# Altium project ESP32.PrjPcb
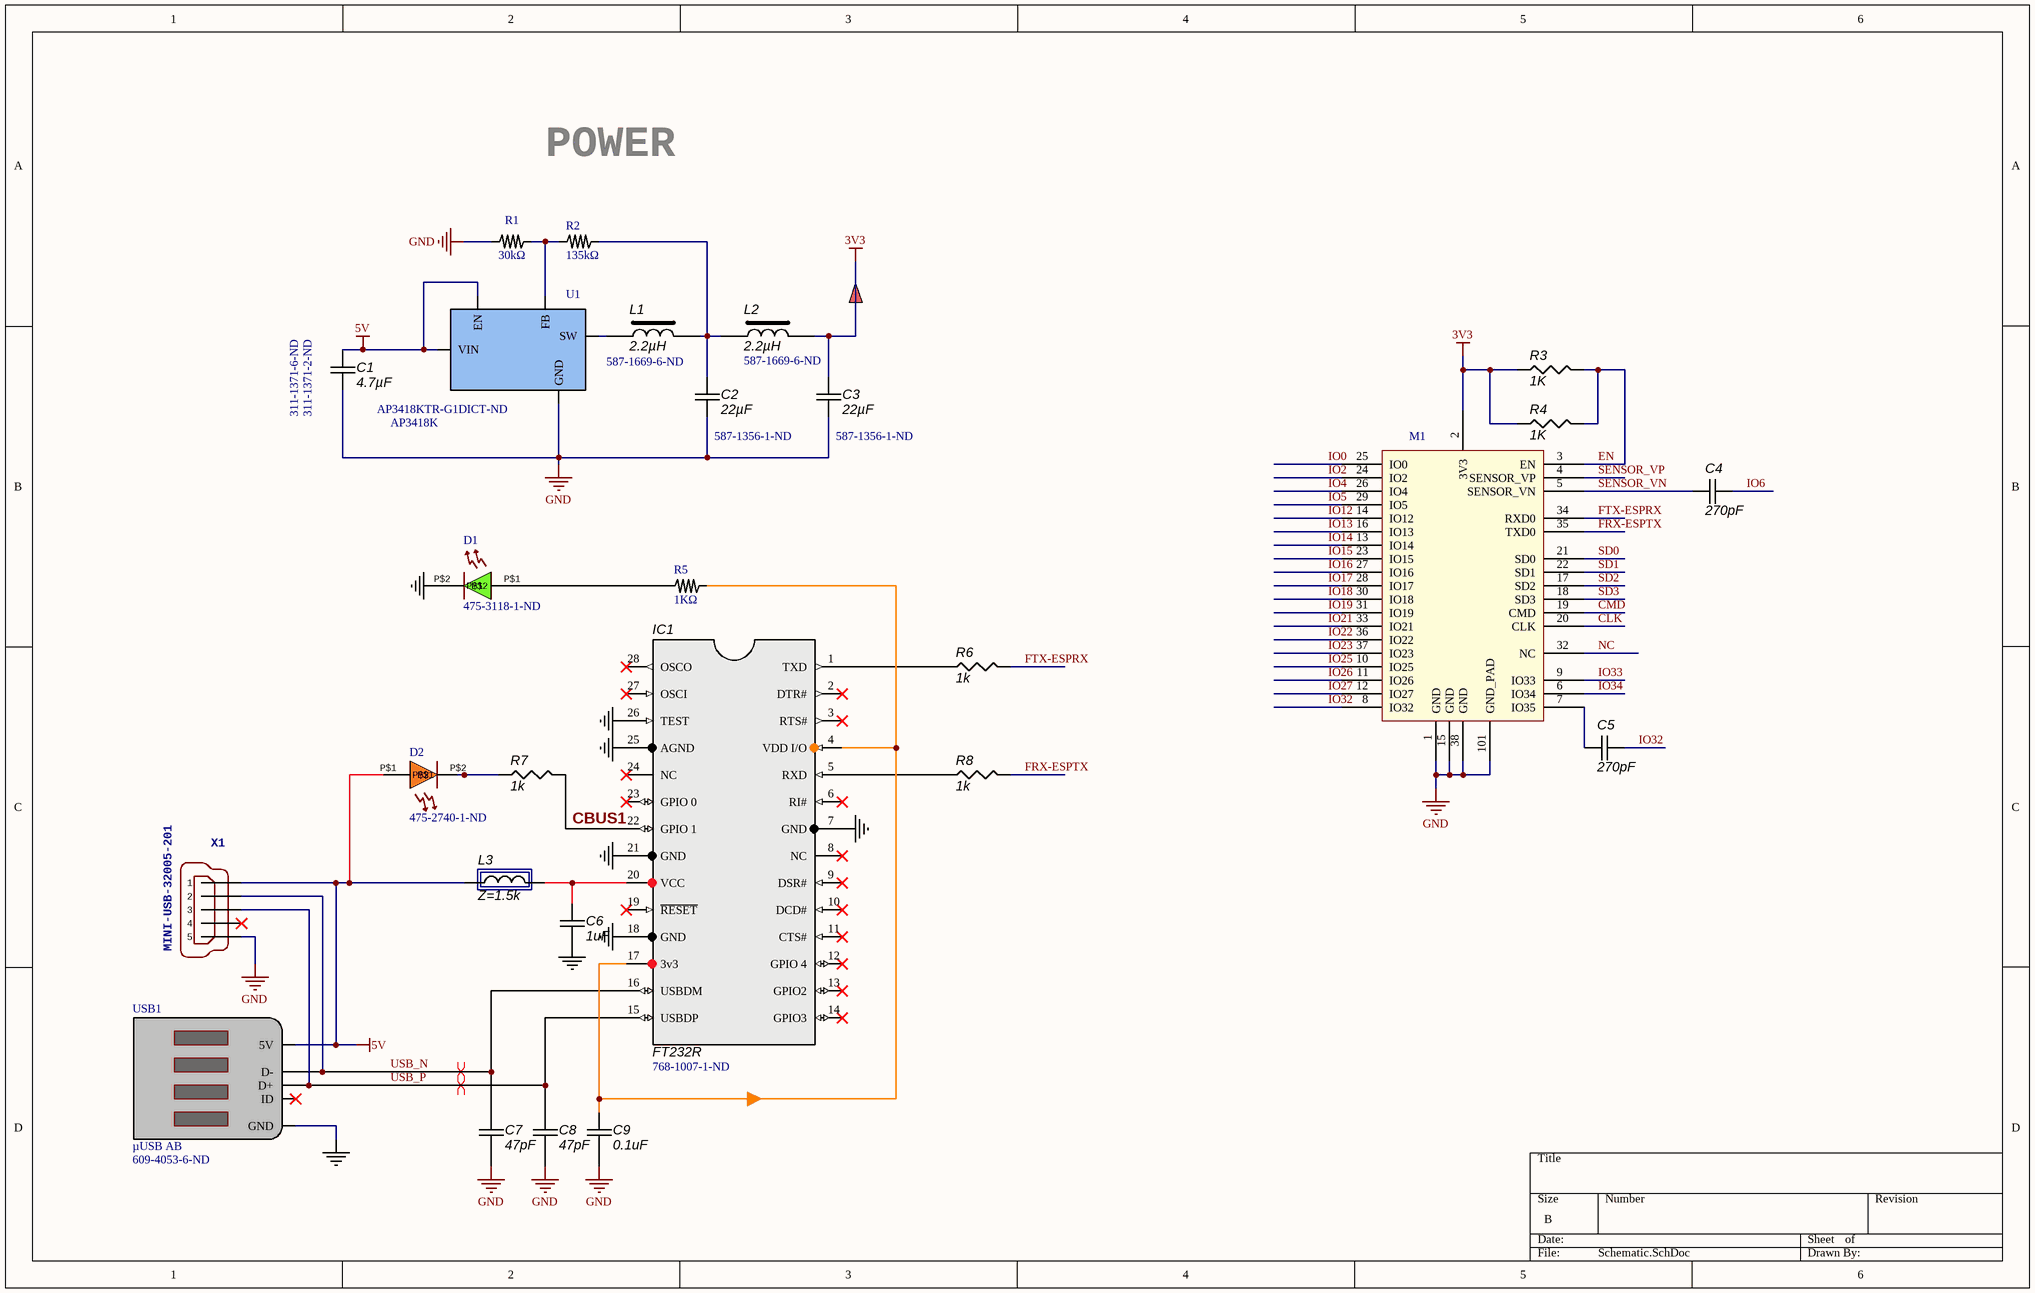
[diagram p0: Schematic.SchDoc]
1 sheet, 27 parts. Net scope: global (net labels, ports and power ports of the same name join across sheets).
Board file: Layout.PcbDoc

## Sheet Schematic.SchDoc
size B

### Parts
C1  4.7µF  Supplier Part Number 1: 311-1371-2-ND  Supplier Part Number 2: 311-1371-6-ND  [0805NT]
C2  22µF  Supplier Part Number 1: 587-1356-1-ND  [1206NT]
C3  22µF  Supplier Part Number 1: 587-1356-1-ND  [1206NT]
C4  270pF  [0603NT]
C5  270pF  [0603NT]
C6  1uF  [0402NT]
C7  47pF  [0603NT]
C8  47pF  [0603NT]
C9  0.1uF  [0603NT]
D1  Supplier Part Number 1: 475-3118-1-ND  [0603(IN)LED]  (hidden comment: SMT_LED)
D2  Supplier Part Number 1: 475-2740-1-ND  [0603(IN)LED]  (hidden comment: SMT_LED)
IC1  FT232R  Supplier Part Number 1: 768-1007-1-ND  [SSOP-28]
L1  2.2µH  Supplier Part Number 1: 587-1669-6-ND  [IND-NR4018]
L2  2.2µH  Supplier Part Number 1: 587-1669-6-ND  [IND-NR4018]
L3  Z=1.5k  [0603NT]
M1  ESP32S_Module  [ESP32S]  (value not drawn)
R1  30kΩ  [0402NT]
R2  135kΩ  [0402NT]
R3  1K  [0402NT]
R4  1K  [0402NT]
R5  1KΩ  [0402NT]
R6  1k  [0402NT]
R7  1k  [0402NT]
R8  1k  [0402NT]
U1  AP3418K  Supplier Part Number 1: AP3418KTR-G1DICT-ND  [AP3418K SOT25]
USB1  µUSB AB  Supplier Part Number 1: 609-4053-6-ND  [Micro USB A/B]
X1  MINI-USB-32005-201  [32005-201]

### Nets
3V3: C3.1 L2.2 M1.2(3V3) R3.1 R4.1
5V: C1.2 D2.P$1 L3.1 U1.1(EN) U1.4(VIN) USB1.1(5V) X1.1
GND: C1.1 C2.2 C3.2 C6.2 C7.2 C8.2 C9.2 D1.P$2 IC1.7(GND) IC1.18(GND) IC1.21(GND) IC1.25(AGND) IC1.26(TEST) M1.1(GND) M1.15(GND) M1.38(GND) M1.101(GND_PAD) R1.1 U1.2(GND) USB1.5(GND) X1.5
CBUS1: IC1.22(GPIO_1) R7.2
CLK: M1.20(CLK)
CMD: M1.19(CMD)
EN: M1.3(EN) R3.2 R4.2
FRX-ESPTX: M1.35(TXD0) R8.2
FTX-ESPRX: M1.34(RXD0) R6.2
IO0: M1.25(IO0)
IO2: M1.24(IO2)
IO4: M1.26(IO4)
IO5: M1.29(IO5)
IO6: C4.2
IO12: M1.14(IO12)
IO13: M1.16(IO13)
IO14: M1.13(IO14)
IO15: M1.23(IO15)
IO16: M1.27(IO16)
IO17: M1.28(IO17)
IO18: M1.30(IO18)
IO19: M1.31(IO19)
IO21: M1.33(IO21)
IO22: M1.36(IO22)
IO23: M1.37(IO23)
IO25: M1.10(IO25)
IO26: M1.11(IO26)
IO27: M1.12(IO27)
IO32: C5.1 M1.8(IO32)
IO33: M1.9(IO33)
IO34: M1.6(IO34)
NC: M1.32(NC)
SD0: M1.21(SD0)
SD1: M1.22(SD1)
SD2: M1.17(SD2)
SD3: M1.18(SD3)
SENSOR_VN: C4.1 M1.5(SENSOR_VN)
SENSOR_VP: M1.4(SENSOR_VP)
USB_N: C7.1 IC1.16(USBDM) USB1.2(D-) X1.2
USB_P: C8.1 IC1.15(USBDP) USB1.3(D+) X1.3
NetC2_1: C2.1 L1.2 L2.1 R2.2
NetC5_2: C5.2 M1.7(IO35)
NetC6_1: C6.1 IC1.20(VCC) L3.2
NetC9_1: C9.1 IC1.4(VDD_I/O) IC1.17(3v3) R5.2
NetD1_P$1: D1.P$1 R5.1
NetD2_P$2: D2.P$2 R7.1
NetIC1_1: IC1.1(TXD) R6.1
NetIC1_5: IC1.5(RXD) R8.1
NetL1_1: L1.1 U1.3(SW)
NetR1_2: R1.2 R2.1 U1.5(FB)

Not connected (* = marked no-connect by the designer): IC1 2(DTR#)* 3(RTS#)* 6(RI#)* 8(NC)* 9(DSR#)* 10(DCD#)* 11(CTS#)* 12(GPIO_4)* 13(GPIO2)* 14(GPIO3)* 19(~{RESET})* 23(GPIO_0)* 24(NC)* 27(OSCI)* 28(OSCO)*; USB1 4(ID)*; X1 4*

### Layout directives
differential pair: USB_N, USB_P

### Notes on the sheet
- POWER

### Library data of the parts
C1 C4 C5 = CAP: Capacitor; Manufacture: Panasonic; Voltage: 50v; Tolerance: 5%; Temperature: -40°C ~ 85°C
  C1: Supplier 1: Digi-Key; Supplier 2: Digi-Key
C2 C3 = CAP: Capacitor; Part #: ECJ-0EC1H101J; Manufacture: Panasonic; Voltage: 50v; Tolerance: 5%; Distributor: Digi Key (PCC101CQCT-ND); Temperature: -40°C ~ 85°C; Supplier 1: Digi-Key
C6 = CAP: Capacitor; Part #: C1608X5R1C105K; Manufacture: TDK; Voltage: 16v; Tolerance: 10%; Notes: X5R / Low ESR; Distributor: Digi Key   445-1416-1-ND; Temperature: -55°C ~ 85°C; Value: 1uF
C7 C8 = CAP: Capacitor; Part #: C1608C0G1H470J; Manufacture: TDK; Voltage: 50v; Tolerance: 5%; Notes: NP0 / Low ESR; Distributor: Digi Key   445-1277-1-ND; Temperature: -55°C ~ 125°C; Value: 47pF
C9 = CAP: Capacitor; Part #: C1608C0G1H470J; Manufacture: TDK; Voltage: 50v; Tolerance: 5%; Notes: NP0 / Low ESR; Value: 47pF; Distributor: Digi Key   445-1277-1-ND; Temperature: -55°C ~ 125°C
IC1 = FT232RL: IC Logic Comm; Manufacture: FTDI; Voltage: 3.3v~5.25v; Tolerance: NA; Notes: 256 Byte FIFO; Part #: FT232RL; Distributor: Digi Key  768-1007-1-ND; Temperature: -40 +85; Value: FT232R; Supplier 1: Digi-Key
L1 L2 = IND-POWER: Inductance Power; Part #: *; Distributor: *; Voltage: *; Tolerance: *; Temperature: *; Supplier 1: Digi-Key
L3 = IND_BEAD: Inductance Bead; Part #: MMZ1608Y152B; Manufacture: TDK; Notes: 300mA / 0.6ohm / 1500 Ohm @ 100MHz; Distributor: Digi Key   445-1553-1-ND; Voltage: N/A; Tolerance: N/A; Temperature: -40°C ~ 85°C; Value: Z=1.5k
M1 = ESP32S_Module: Esp-32S; Datasheet: https://espressif.com/sites/default/files/documentation/esp_wroom_32_datasheet_en.pdf
R1 R2 R5 = ResNico
R3 R4 = RES: Resistance
R6 R8 = RES: Resistance; Part #: ERJ-3GEYJ473V; Manufacture: Panasonics; Voltage: 50v; Tolerance: ±5%; Notes: 0.1W / ±200ppm/°C; Value: 47k; Distributor: Digi Key   P47KGCT-ND; Temperature: -40 +85
R7 = RES: Resistance; Part #: ERJ-3GEYJ271V; Manufacture: Panasonic; Voltage: 50v; Tolerance: ±5%; Notes: 0.1W / ±200ppm/°C; Value: 270ohm; Distributor: Digi Key   P270GCT-ND; Temperature: -40 +85
USB1 = Micro USB A/B: Supplier 1: Digi-Key
X1 = MINI-USB-32005-201: <b>MINI USB-B Conector</b><p> / Source: www.cypressindustries.com; OC_FARNELL: unknown; OC_NEWARK: unknown
D1 D2 = SMT_LED: Supplier 1: Digi-Key
U1 = AP3418K: Supplier 1: Digi-Key